# EAGLE design midi_block_R2_2 (EAGLE 6.6.0)
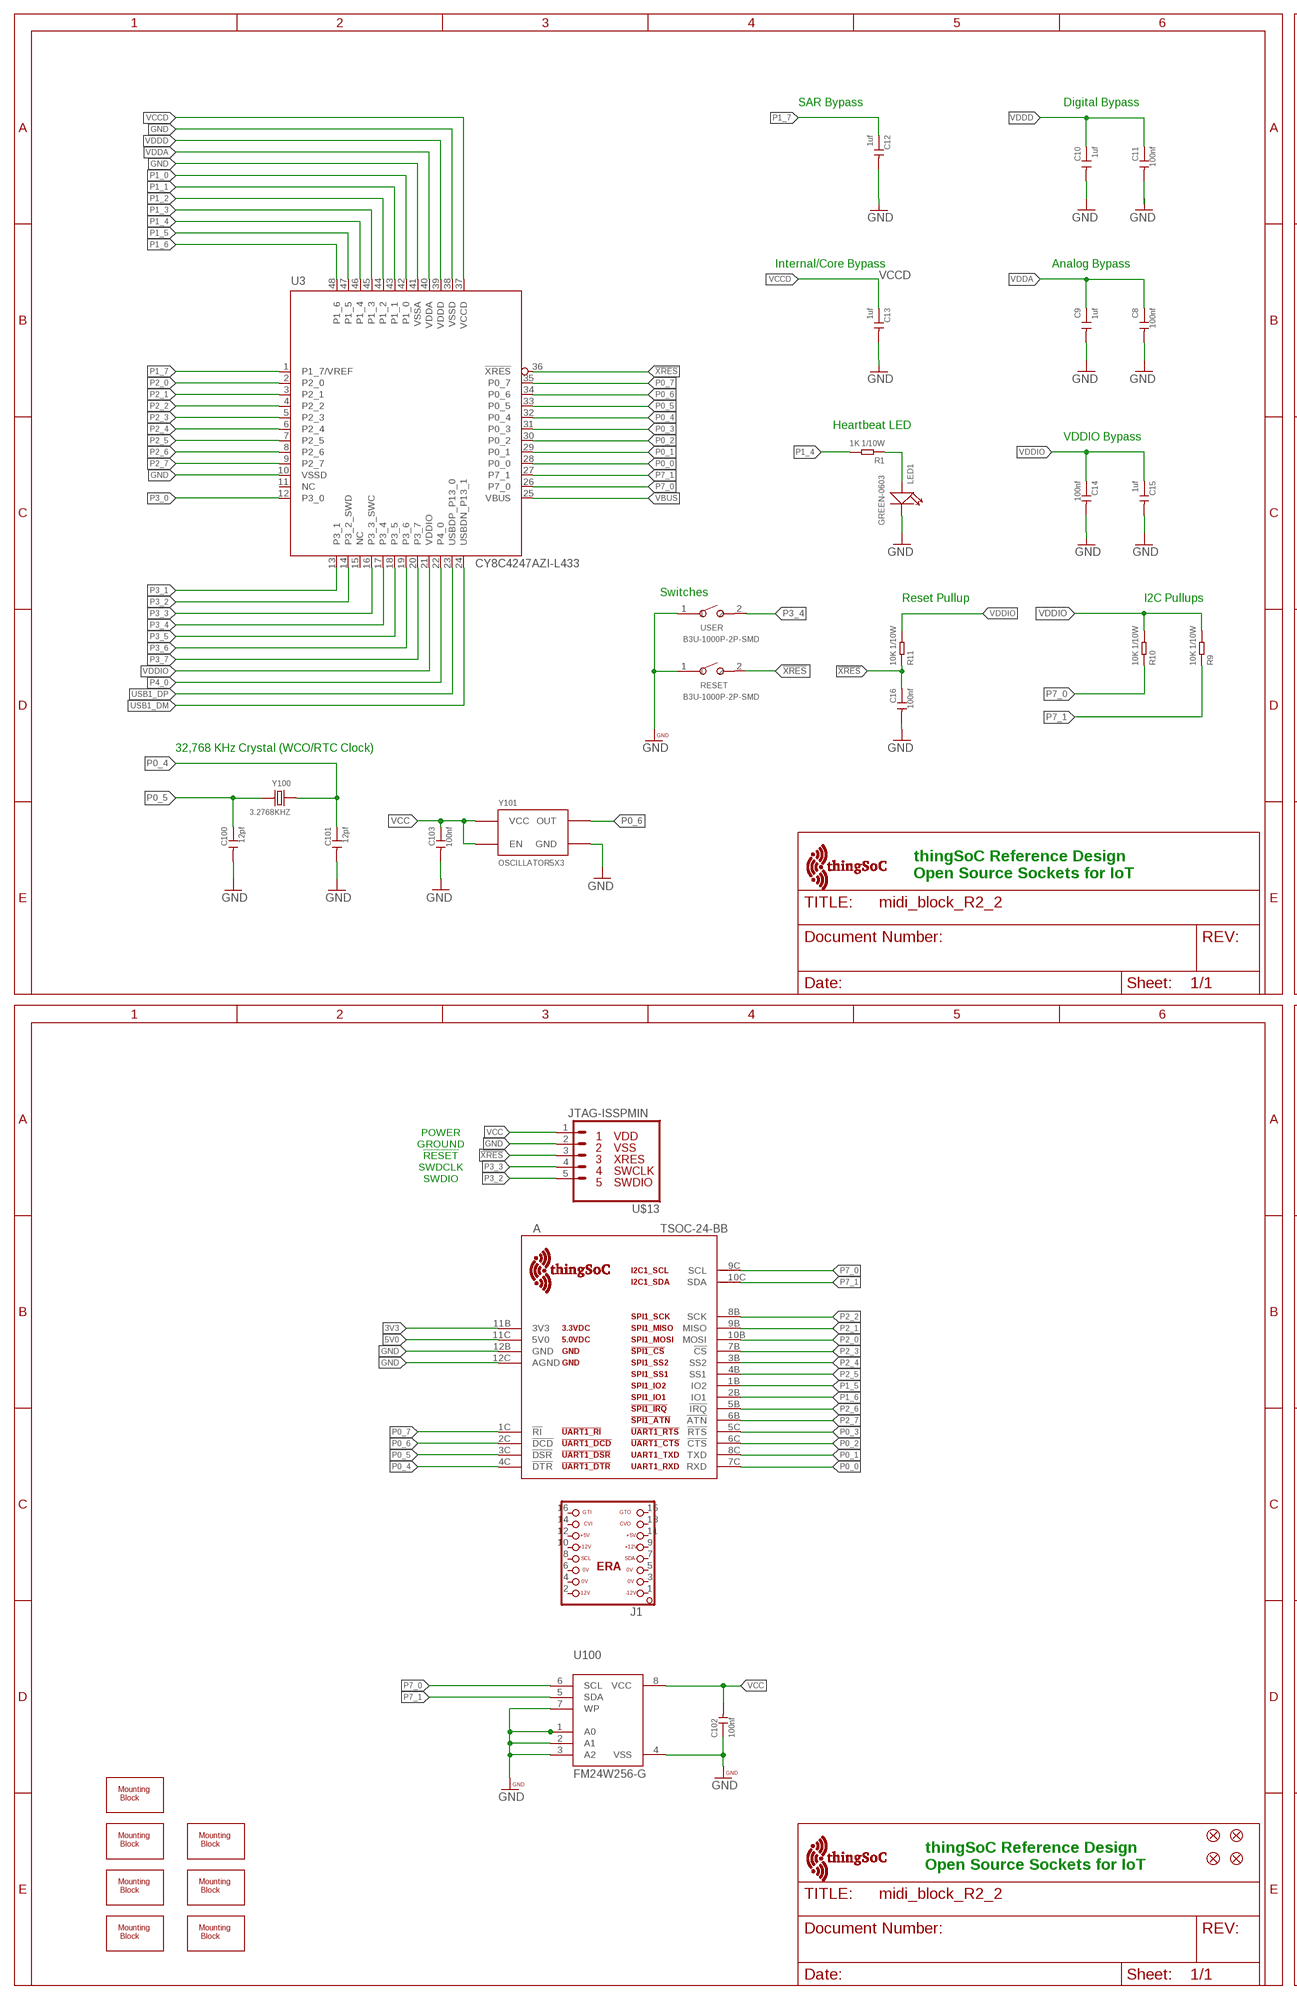
[diagram p0: schematic, sheet 1, part 1 of 2]
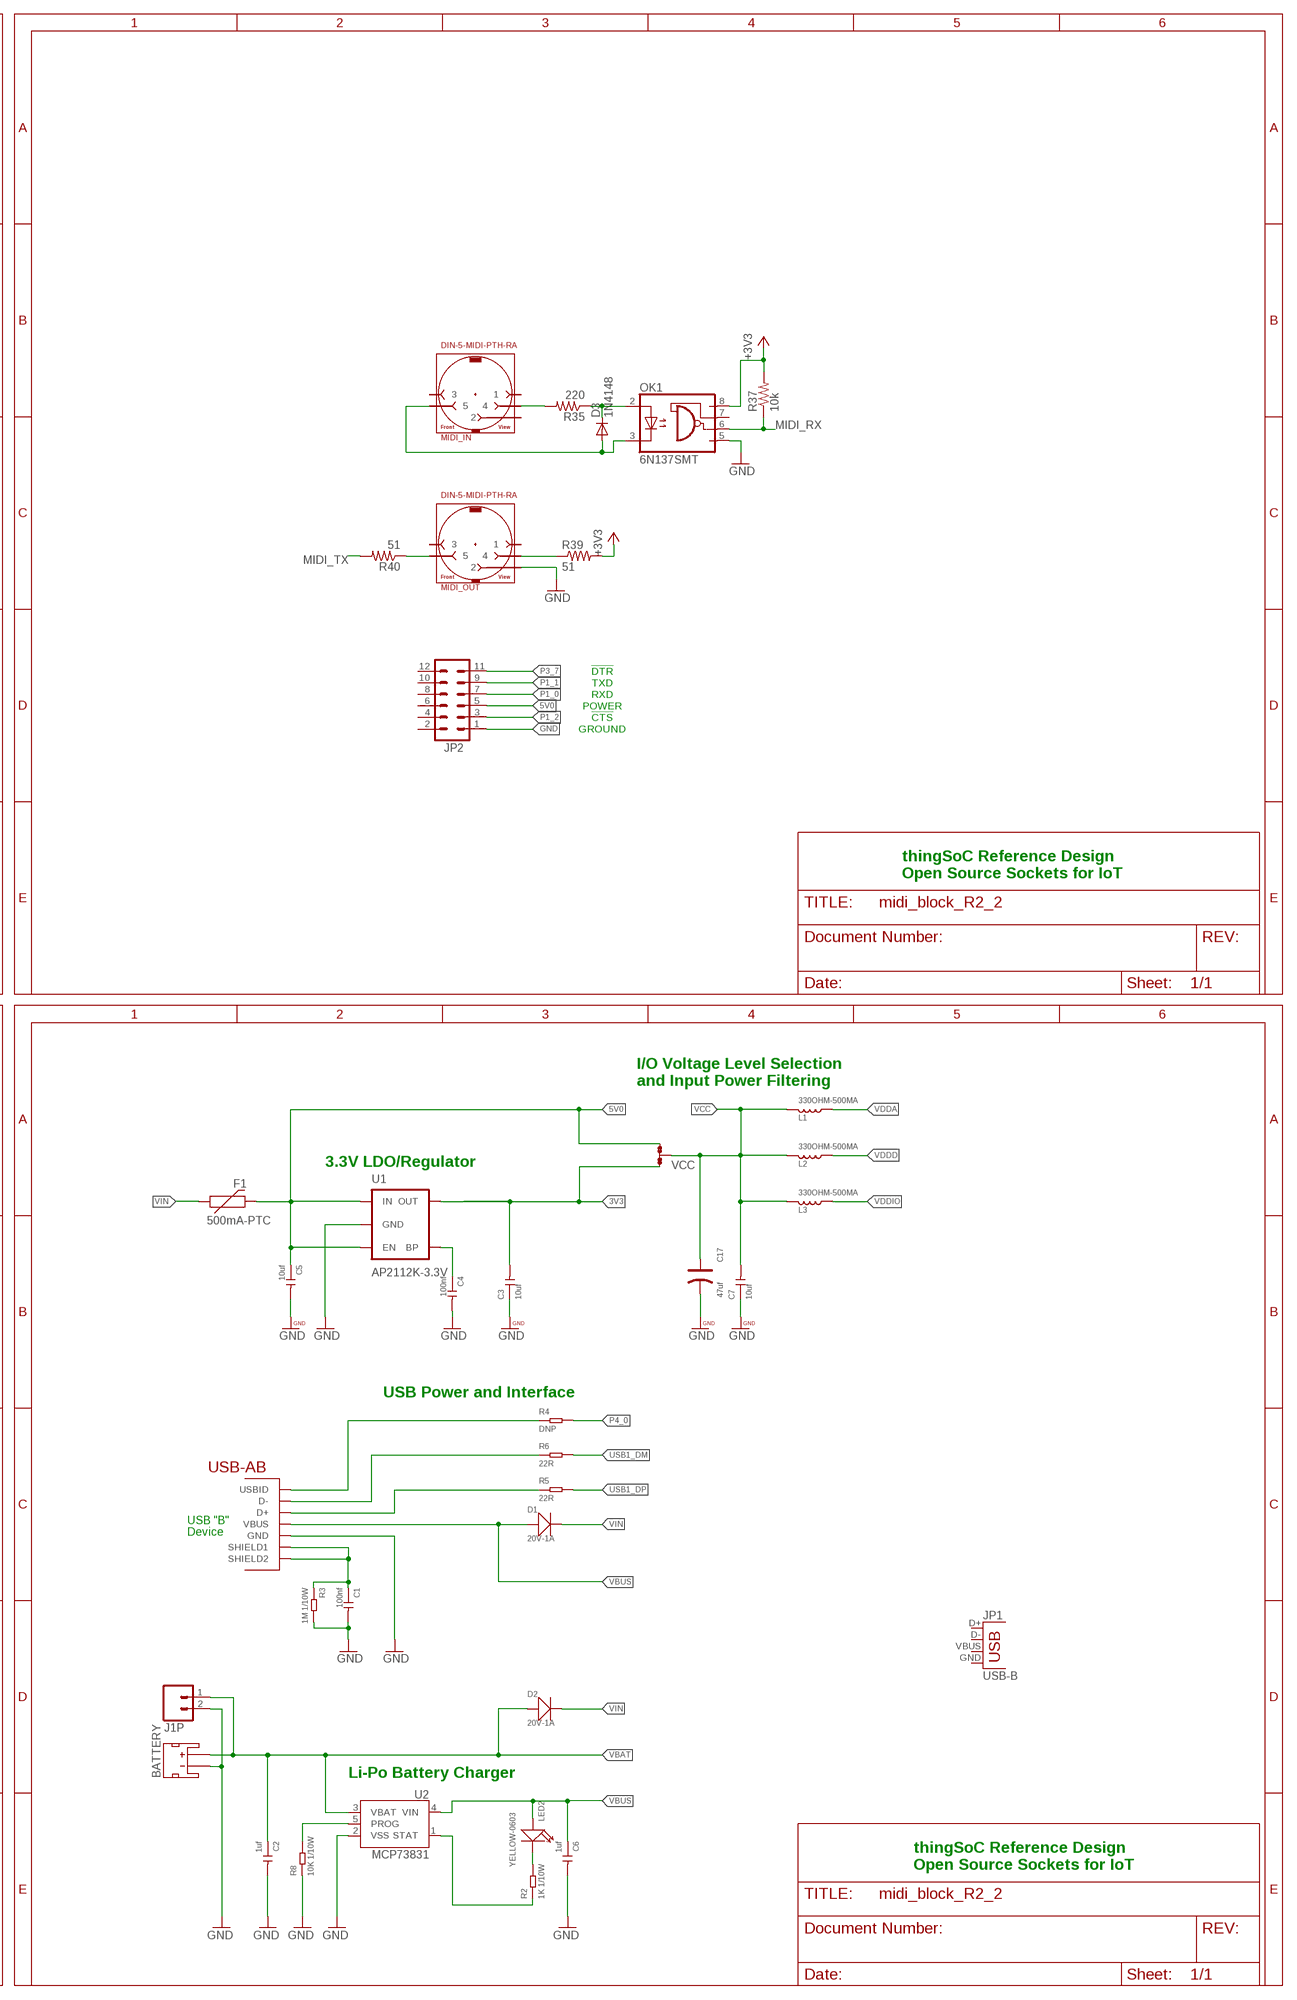
[diagram p1: schematic, sheet 1, part 2 of 2]

## Parts
A  TSOC-24-BB  [TSOC-BB-S24]
BATTERY  JST_2MM_MALE  [JST-2-SMD]
C1  100nf  CERAMIC-100NF-50V-10%-X7R(0603)  [C0603]
C2  1uf  CERAMIC-1UF-25V-10%-X7R(0603)  [C0603]
C3  10uf  CERAMIC-10UF-10V-10%-X5R(0603)  [C0603]
C4  100nf  CERAMIC-100NF-50V-10%-X7R(0603)  [C0603]
C5  10uf  CERAMIC-10UF-10V-10%-X5R(0603)  [C0603]
C6  1uf  CERAMIC-1UF-25V-10%-X7R(0603)  [C0603]
C7  10uf  CERAMIC-10UF-10V-10%-X5R(0603)  [C0603]
C8  100nf  CERAMIC-100NF-50V-10%-X7R(0603)  [C0603]
C9  1uf  CERAMIC-1UF-25V-10%-X7R(0603)  [C0603]
C10  1uf  CERAMIC-1UF-25V-10%-X7R(0603)  [C0603]
C11  100nf  CERAMIC-100NF-50V-10%-X7R(0603)  [C0603]
C12  1uf  CERAMIC-1UF-25V-10%-X7R(0603)  [C0603]
C13  1uf  CERAMIC-1UF-25V-10%-X7R(0603)  [C0603]
C14  100nf  CERAMIC-100NF-50V-10%-X7R(0603)  [C0603]
C15  1uf  CERAMIC-1UF-25V-10%-X7R(0603)  [C0603]
C16  100nf  CERAMIC-100NF-50V-10%-X7R(0603)  [C0603]
C17  47uf  TANTALUM-SMD-47UF-6.3V(AVX-A)  [AVX-A]
C100  12pf  CERAMIC-12PF-50V-5%-NPO(0603)  [C0603]
C101  12pf  CERAMIC-12PF-50V-5%-NPO(0603)  [C0603]
C102  100nf  CERAMIC-100NF-50V-10%-X7R(0603)  [C0603]
C103  100nf  CERAMIC-100NF-50V-10%-X7R(0603)  [C0603]
D1  20V-1A  SMD-DIODE-SCHOTTKY-20V-1A(SOD-123)  [SOD-123]
D2  20V-1A  SMD-DIODE-SCHOTTKY-20V-1A(SOD-123)  [SOD-123]
D3  1N4148  DIODE-SOD323-W  [SOD323-W]
F1  500mA-PTC  PTCSMD  [PTC-1206]
FID1  FIDUCIALUFIDUCIAL  [MICRO-FIDUCIAL]
FID2  FIDUCIALUFIDUCIAL  [MICRO-FIDUCIAL]
FID3  FIDUCIALUFIDUCIAL  [MICRO-FIDUCIAL]
FID4  FIDUCIALUFIDUCIAL  [MICRO-FIDUCIAL]
J1  ERA-SHROUD  [ERA]
J1P  M02-JST-2-PTH-NO_SILK  [JST-2-PTH-NS]
JP1  USB-B  USBPTH  [USB-B-PTH]
JP2  M06X2FEMALE-SMT  [2X6_SMD]
L1  330OHM-500MA  SMD-FERRITE-CHIP-120-OHM-500MA(0603)  [L0603]
L2  330OHM-500MA  SMD-FERRITE-CHIP-120-OHM-500MA(0603)  [L0603]
L3  330OHM-500MA  SMD-FERRITE-CHIP-120-OHM-500MA(0603)  [L0603]
LED1  GREEN-0603  SMD-LED-CLEAR-GREEN(0603)  [LED-0603]
LED2  YELLOW-0603  SMD-LED-CLEAR-YELLOW(0603)  [LED-0603]
MIDI_IN  DIN-5-MIDI-PTH-RA  [DIN-5-PTH-RA-SUPPORT]
MIDI_OUT  DIN-5-MIDI-PTH-RA  [DIN-5-PTH-RA-SUPPORT]
OK1  6N137SMT  [DIL8-SMD]
R1  1K 1/10W  SMD-RES-1K-5%-1/10W(0603)  [R0603]
R2  1K 1/10W  SMD-RES-1K-5%-1/10W(0603)  [R0603]
R3  1M 1/10W  SMD-RES-1M-5%-1/10W(0603)  [R0603]
R4  DNP  SMD-RES-22R-5%-1/10W(0603)  [R0603]
R5  22R  SMD-RES-22R-5%-1/10W(0603)  [R0603]
R6  22R  SMD-RES-22R-5%-1/10W(0603)  [R0603]
R8  10K 1/10W  SMD-RES-10K-5%-1/10W(0603)  [R0603]
R9  10K 1/10W  SMD-RES-10K-5%-1/10W(0603)  [R0603]
R10  10K 1/10W  SMD-RES-10K-5%-1/10W(0603)  [R0603]
R11  10K 1/10W  SMD-RES-10K-5%-1/10W(0603)  [R0603]
R35  220  R-US_R0603  [R0603]
R37  10k  R-US_R0603  [R0603]
R39  51  R-US_R0603  [R0603]
R40  51  R-US_R0603  [R0603]
RESET  B3U-1000P-2P-SMD  SMD-BUTTON(2P-3.0X2.5X1.2+0.4MM)-B3U-1000P-2P-SMD  [SW2-2.6-3.0X2.5X1.2+0.4MM]
U1  AP2112K-3.3V  V_REG_LDOSMD  [SOT23-5]
U2  MCP73831  [SOT23-5]
U3  CY8C4247AZI-L433  [TQFP-7X7-48]
U100  FM24W256-G  [SO08]
U$1  PCB-MB-SIDE  [PCB-MB-01-SIDE]
U$7  PCB-MB-SIDE  [PCB-MB-01-SIDE]
U$8  PCB-MB-SIDE  [PCB-MB-01-SIDE]
U$9  PCB-MB-SIDE  [PCB-MB-01-SIDE]
U$10  PCB-MB-SIDE  [PCB-MB-01-SIDE]
U$11  PCB-MB-SIDE  [PCB-MB-01-SIDE]
U$12  PCB-MB-SIDE  [PCB-MB-01-SIDE]
U$13  JTAG-ISSPMIN  [PSOC_JTAG_MINSILK]
U$100  TSOC-LOGO-LRG  [TSOC-LOGO-LRG]
U$101  TSOC-LOGO-SMALL  [TSOC-LOGO-SML]
USB  USB_AB  [USB-AB-MICRO-SMD]
USER  B3U-1000P-2P-SMD  SMD-BUTTON(2P-3.0X2.5X1.2+0.4MM)-B3U-1000P-2P-SMD  [SW2-2.6-3.0X2.5X1.2+0.4MM]
VCC  JMP-3-1_2  [JMP-3-1_2]
Y100  3.2768KHZ  SMD-CRYSTAL-32.768KHZ-12.5PF-20PPM-90K(2P-L2.0X1.2MM)  [X2-SMD-L2.0X1.2X0.55MM]
Y101  OSCILLATOR5X3  [CRYSTAL-SMD-5X3]

## Nets
3V3: A.11B(3V3) C3.2 U1.5(OUT) VCC.1
5V0: A.11C(5V0) C5.1 F1.2 JP2.5 U1.1(IN) U1.3(EN) VCC.3
!XRES: C16.1 R11.1 RESET.2 U3.36(!XRES) U$13.3
+3V3: OK1.8(VCC) R37.2 R39.2
BYPASS1: C4.1 U1.4(BP)
CLED: LED2.- R2.2
CSTAT: R2.1 U2.1(STAT)
GND: A.12B(GND) A.12C(AGND) BATTERY.1(-) C1.2 C2.2 C3.1 C4.2 C5.2 C6.2 C7.1 C8.2 C9.2 C10.2 C11.2 C12.2 C13.2 C14.2 C15.2 C16.2 C17.- C100.2 C101.2 C102.1 C103.2 J1P.2 JP2.1 LED1.- MIDI_OUT.2 OK1.5(GND) R3.2 R8.1 RESET.1 U1.2(GND) U2.2(VSS) U3.10(VSSD) U3.38(VSSD) U3.41(VSSA) U100.1(A0) U100.2(A1) U100.3(A2) U100.4(VSS) U100.7(WP) U$13.2 USB.GND USER.1 Y101.2(GND)
MIDI_RX: OK1.6(VO) R37.1
MIDI_TX: R40.2
N$1: R8.2 U2.5(PROG)
N$8: D3.C OK1.2(A) R35.1
N$9: MIDI_IN.4 R35.2
N$10: MIDI_OUT.5 R40.1
N$12: D3.A MIDI_IN.5 OK1.3(C)
N$13: MIDI_OUT.4 R39.1
N$17: LED1.+ R1.1
P0_0: A.7C(RXD) U3.28(P0_0)
P0_1: A.8C(TXD) U3.29(P0_1)
P0_2: A.6C(!CTS) U3.30(P0_2)
P0_3: A.5C(!RTS) U3.31(P0_3)
P0_4: A.4C(!DTR) C101.1 U3.32(P0_4) Y100.1
P0_5: A.3C(!DSR) C100.1 U3.33(P0_5) Y100.2
P0_6: A.2C(!DCD) U3.34(P0_6) Y101.3(OUT)
P0_7: A.1C(!RI) U3.35(P0_7)
P1_0: JP2.7 U3.42(P1_0)
P1_1: JP2.9 U3.43(P1_1)
P1_2: JP2.3 U3.44(P1_2)
P1_3: U3.45(P1_3)
P1_4: R1.2 U3.46(P1_4)
P1_5: A.1B(IO2) U3.47(P1_5)
P1_6: A.2B(IO1) U3.48(P1_6)
P1_7: C12.1 U3.1(P1_7/VREF)
P2_0: A.10B(MOSI) U3.2(P2_0)
P2_1: A.9B(MISO) U3.3(P2_1)
P2_2: A.8B(SCK) U3.4(P2_2)
P2_3: A.7B(!CS) U3.5(P2_3)
P2_4: A.3B(SS2) U3.6(P2_4)
P2_5: A.4B(SS1) U3.7(P2_5)
P2_6: A.5B(!IRQ) U3.8(P2_6)
P2_7: A.6B(!ATN) U3.9(P2_7)
P3_0: U3.12(P3_0)
P3_1: U3.13(P3_1)
P3_2: U3.14(P3_2_SWD) U$13.5
P3_3: U3.16(P3_3_SWC) U$13.4
P3_4: U3.17(P3_4) USER.2
P3_5: U3.18(P3_5)
P3_6: U3.19(P3_6)
P3_7: JP2.11 U3.20(P3_7)
P4_0: R4.2 U3.22(P4_0)
P7_0: A.9C(SCL) R10.1 U3.26(P7_0) U100.6(SCL)
P7_1: A.10C(SDA) R9.1 U3.27(P7_1) U100.5(SDA)
USB1_DM: R6.2 U3.24(USBDN_P13_1)
USB1_DP: R5.2 U3.23(USBDP_P13_0)
USB1_I: R4.1 USB.ID(USBID)
USB1_M: R6.1 USB.D-
USB1_P: R5.1 USB.D+
USB1_SHIELD: C1.1 R3.1 USB.SHIELD1 USB.SHIELD2
VBAT: BATTERY.2(+) C2.1 D2.+ J1P.1 U2.3(VBAT)
VBUS: C6.1 D1.+ LED2.+ U2.4(VIN) U3.25(VBUS) USB.VBUS
VCC: C7.2 C17.+ C102.2 C103.1 L1.1 L2.1 L3.1 U100.8(VCC) U$13.1 VCC.2 Y101.1(EN) Y101.4(VCC)
VCCD: C13.1 U3.37(VCCD)
VDDA: C8.1 C9.1 L1.2 U3.40(VDDA)
VDDD: C10.1 C11.1 L2.2 U3.39(VDDD)
VDDIO: C14.1 C15.1 L3.2 R9.2 R10.2 R11.2 U3.21(VDDIO)
VIN: D1.- D2.- F1.1
Unconnected: BATTERY.NC1(PAD1) BATTERY.NC2(PAD2) J1.1 J1.2 J1.3 J1.4 J1.5 J1.6 J1.7 J1.8 J1.9 J1.10 J1.11 J1.12 J1.13 J1.14 J1.15 J1.16 JP1.D+ JP1.D- JP1.GND JP1.VBUS JP2.2 JP2.4 JP2.6 JP2.8 JP2.10 JP2.12 MIDI_IN.1 MIDI_IN.2 MIDI_IN.3 MIDI_OUT.1 MIDI_OUT.3 OK1.7(VE) U3.11(NC) U3.15(NC)

## Notes on the sheet
- SAR Bypass | Digital Bypass
- Internal/Core Bypass | Analog Bypass
- Heartbeat LED
- VDDIO Bypass
- Switches
- Reset Pullup | I2C Pullups
- !DTR
- TXD
- RXD
- POWER
- !CTS
- GROUND
- 32,768 KHz Crystal (WCO/RTC Clock)
- thingSoC Reference Design
  Open Source Sockets for IoT
- thingSoC Reference Design
  Open Source Sockets for IoT
- I/O Voltage Level Selection
  and Input Power Filtering
- POWER
- GROUND
- !RESET
- SWDCLK | 3.3V LDO/Regulator
- SWDIO
- USB Power and Interface
- USB "B"
- Device
- Li-Po Battery Charger
- thingSoC Reference Design
  Open Source Sockets for IoT
- thingSoC Reference Design
  Open Source Sockets for IoT

## Library data of the parts
A = thingSoC:TSOC-24: thingSoC Twenty-Four(24) Pin Socket Source LBR : http://www.thingsoc.com Github : https://github.com/thingsoc License : http://creativecommons.org/licenses/by-sa/4.0/ (Creative Commons 4.0) THIS SOFTWARE IS PROVIDED BY THE CONTRIBUTORS "AS IS" AND WITHOUT ANY EXPRESS OR IMPLIED WARRANTIES, INCLUDING, BUT NOT LIMITED TO, THE IMPLIED WARRANTIES OF MERCHANTABILITY AND FITNESS FOR A PARTICULAR PURPOSE ARE DISCLAIMED. IN NO EVENT SHALL THE COPYRIGHT OWNER OR CONTRIBUTORS BE LIABLE FOR ANY DIRECT, INDIRECT, INCIDENTAL, SPECIAL, EXEMPLARY, OR CONSEQUENTIAL DAMAGES (INCLUDING, BUT NOT LIMITED TO, PROCUREMENT OF SUBSTITUTE GOODS OR SERVICES; LOSS OF USE, DATA, OR PROFITS; OR BUSINESS INTERRUPTION) HOWEVER CAUSED AND ON ANY THEORY OF LIABILITY, WHETHER IN CONTRACT, STRICT LIABILITY, OR TORT (INCLUDING NEGLIGENCE OR OTHERWISE) ARISING IN ANY WAY OUT OF THE USE OF THIS SOFTWARE, EVEN IF ADVISED OF THE POSSIBILITY OF SUCH DAMAGE.
BATTERY = TSOC-ESP8266-BASE:JST_2MM_MALE: Mates to single-cell LiPo batteries. CONN-11443 Now with smashable polarity marks!; BTM_NEG: -; BTM_POS: +; PROD_ID: CONN-11443; TOP_NEG: -; TOP_POS: +
C1 C4 C8 C11 C14 C16 C102 C103 = Seeed-Capacitor-2016:CERAMIC-100NF-50V-10%-X7R(0603): 302010138; MPN: CC0603KRX7R9BB104
C2 C6 C9 C10 C12 C13 C15 = Seeed-Capacitor-2016:CERAMIC-1UF-25V-10%-X7R(0603): 302010139; MPN: CC0603KRX7R8BB105
C3 C5 C7 = Seeed-Capacitor-2016:CERAMIC-10UF-10V-10%-X5R(0603): 302010103; MPN: CC0603KRX5R6BB106
C17 = Seeed-Capacitor-2016:TANTALUM-SMD-47UF-6.3V(AVX-A): 302020005; MPN: TAJA476*006#NJ
C100 C101 = Seeed-Capacitor-2016:CERAMIC-12PF-50V-5%-NPO(0603): 302010067; MPN: CC0603JRNPO9BN120
D1 D2 = Seeed-Diode-2016:SMD-DIODE-SCHOTTKY-20V-1A(SOD-123): 304020034; MPN: B5819W
D3 = diode:DIODE-: DIODE
F1 = SparkFun:PTC: Resettable Fuse PTC Resettable Fuse. Spark Fun Electronics SKU : COM-08357
FID1-FID4 = TSOC-ESP8266-BASE:FIDUCIAL: Fiducial Alignment Points Various fiducial points for machine vision alignment.
J1 = ERA:ERA: EuroRack2 - Backplane Connector
J1P = TSOC-ESP8266-BASE:M02: Standard 2-pin 0.1" header. Use with - straight break away headers ( PRT-00116) - right angle break away headers (PRT-00553) - swiss pins (PRT-00743) - machine pins (PRT-00117) - female headers (PRT-00115) Molex polarized connector foot print use with: PRT-08233 with associated crimp pins and housings. 2.54_SCREWTERM for use with PRT-10571. 3.5mm Screw Terminal footprints for PRT-08084 5mm Screw Terminal footprints for use with PRT-08432
JP1 = SparkFun-Connectors:USB: USB Connectors USB-B-PTH is fully proven SKU : PRT-00139/CONN-08278 USB-miniB is fully proven SKU : PRT-00587 USB-A-PCB is untested. USB-A-H is throughly reviewed, but untested. Spark Fun Electronics SKU : PRT-00437 USB-B-SMT is throughly reviewed, but untested. Needs silkscreen touching up. USB-A-S has not been used/tested USB-MB-H has not been used/tested USB-MICROB has been used. CONN-09505; PROD_ID: CONN-08278
JP2 = halcyonmod_Connectors:M06X2
L1-L3 = Seeed-Inductor-2016:SMD-FERRITE-CHIP-120-OHM-500MA(0603): 303030001; MPN: BLM18AG121SN1D; VALUE: 120OHM-500MA
LED1 = Seeed-LED-2016:SMD-LED-CLEAR-GREEN(0603): 304090043; MPN: 19-217-G7C-AN1P2-3T
LED2 = Seeed-LED-2016:SMD-LED-CLEAR-YELLOW(0603): 304090044; MPN: 19-217-Y5C-AM1N1VY-3T
MIDI_IN MIDI_OUT = oXo_connectors:DIN-5-MIDI: DIN-5 (MIDI) connector
OK1 = og-optocouplers:6N137: MOTOROLA OPTO COUPLER
R1 R2 = Seeed-Resistor-2016:SMD-RES-1K-5%-1/10W(0603): 301010291; MPN: RC0603JR-071KL
R3 = Seeed-Resistor-2016:SMD-RES-1M-5%-1/10W(0603): 301010100; MPN: RC0603JR-071ML
R4 = Seeed-Resistor-2016:SMD-RES-22R-5%-1/10W(0603): 301010289; MPN: RC0603JR-0722RL; VALUE: 22R
R5 R6 = Seeed-Resistor-2016:SMD-RES-22R-5%-1/10W(0603): 301010289; MPN: RC0603JR-0722RL
R8-R11 = Seeed-Resistor-2016:SMD-RES-10K-5%-1/10W(0603): 301010293; MPN: RC0603JR-0710KL
R35 R37 R39 R40 = rcl:R-US_: RESISTOR, American symbol
RESET USER = Seeed-Switch-2016:SMD-BUTTON(2P-3.0X2.5X1.2+0.4MM): 311020047; MPN: B3U-1000P-2P-SMD
U1 = SparkFun-PowerIC:V_REG_LDO: Voltage Regulator LDO Standard 150mA LDO voltage regulator in SOT-23 layout. Micrel part MIC5205. BP (by-pass) pin is used to lower output noise with 470pF cap.; PROD_ID: VREG-12457
U2 = TSOC-ESP8266-BASE:MCP73831: Miniature single cell, fully integrated Li-Ion, Li-polymer charge management controller http://ww1.microchip.com/downloads/en/DeviceDoc/20001984g.pdf IC-09995; PROD_ID: IC-09995
U3 = PatternAgents-Cypress:CY8C4247AZI-L433: Cypress PSoC® 4 - Programmable System on Chip, Cortex-M0 Based : USB Version! http://www.cypress.com/?mpn=CY8C4247AZI-L433 LBR Source: http://www.patternagents.com THIS SOFTWARE IS PROVIDED BY THE CONTRIBUTORS "AS IS" AND WITHOUT ANY EXPRESS OR IMPLIED WARRANTIES, INCLUDING, BUT NOT LIMITED TO, THE IMPLIED WARRANTIES OF MERCHANTABILITY AND FITNESS FOR A PARTICULAR PURPOSE ARE DISCLAIMED. IN NO EVENT SHALL THE COPYRIGHT OWNER OR CONTRIBUTORS BE LIABLE FOR ANY DIRECT, INDIRECT, INCIDENTAL, SPECIAL, EXEMPLARY, OR CONSEQUENTIAL DAMAGES (INCLUDING, BUT NOT LIMITED TO, PROCUREMENT OF SUBSTITUTE GOODS OR SERVICES; LOSS OF USE, DATA, OR PROFITS; OR BUSINESS INTERRUPTION) HOWEVER CAUSED AND ON ANY THEORY OF LIABILITY, WHETHER IN CONTRACT, STRICT LIABILITY, OR TORT (INCLUDING NEGLIGENCE OR OTHERWISE) ARISING IN ANY WAY OUT OF THE USE OF THIS SOFTWARE, EVEN IF ADVISED OF THE POSSIBILITY OF SUCH DAMAGE.
U100 = PatternAgents-Cypress:FM24W256: I2C FRAM FM24W256
U$1 U$7-U$12 = halcyonmod_Hardware:PCB-MB: Mounting Block Hardware Attaches two PCB's at a Right Angle using #4 Self-Threading Screws Source: http://www.essentracomponents.com.sg/images-line/pdfs/PCB-MB.pdf
U$13 = PatternAgents-Cypress:JTAG-ISSP: JTAG-ISSP Programming Connector (5 Pin ISSP JTAG Connector) LBR Source: http://www.patternagents.com THIS SOFTWARE IS PROVIDED BY THE CONTRIBUTORS "AS IS" AND WITHOUT ANY EXPRESS OR IMPLIED WARRANTIES, INCLUDING, BUT NOT LIMITED TO, THE IMPLIED WARRANTIES OF MERCHANTABILITY AND FITNESS FOR A PARTICULAR PURPOSE ARE DISCLAIMED. IN NO EVENT SHALL THE COPYRIGHT OWNER OR CONTRIBUTORS BE LIABLE FOR ANY DIRECT, INDIRECT, INCIDENTAL, SPECIAL, EXEMPLARY, OR CONSEQUENTIAL DAMAGES (INCLUDING, BUT NOT LIMITED TO, PROCUREMENT OF SUBSTITUTE GOODS OR SERVICES; LOSS OF USE, DATA, OR PROFITS; OR BUSINESS INTERRUPTION) HOWEVER CAUSED AND ON ANY THEORY OF LIABILITY, WHETHER IN CONTRACT, STRICT LIABILITY, OR TORT (INCLUDING NEGLIGENCE OR OTHERWISE) ARISING IN ANY WAY OUT OF THE USE OF THIS SOFTWARE, EVEN IF ADVISED OF THE POSSIBILITY OF SUCH DAMAGE.
U$100 U$101 = thingSoC:TSOC-LOGO: thingSoC Logo Source LBR : http://www.thingsoc.com Github : https://github.com/thingsoc License : http://creativecommons.org/licenses/by-sa/4.0/ (Creative Commons 4.0) THIS SOFTWARE IS PROVIDED BY THE CONTRIBUTORS "AS IS" AND WITHOUT ANY EXPRESS OR IMPLIED WARRANTIES, INCLUDING, BUT NOT LIMITED TO, THE IMPLIED WARRANTIES OF MERCHANTABILITY AND FITNESS FOR A PARTICULAR PURPOSE ARE DISCLAIMED. IN NO EVENT SHALL THE COPYRIGHT OWNER OR CONTRIBUTORS BE LIABLE FOR ANY DIRECT, INDIRECT, INCIDENTAL, SPECIAL, EXEMPLARY, OR CONSEQUENTIAL DAMAGES (INCLUDING, BUT NOT LIMITED TO, PROCUREMENT OF SUBSTITUTE GOODS OR SERVICES; LOSS OF USE, DATA, OR PROFITS; OR BUSINESS INTERRUPTION) HOWEVER CAUSED AND ON ANY THEORY OF LIABILITY, WHETHER IN CONTRACT, STRICT LIABILITY, OR TORT (INCLUDING NEGLIGENCE OR OTHERWISE) ARISING IN ANY WAY OUT OF THE USE OF THIS SOFTWARE, EVEN IF ADVISED OF THE POSSIBILITY OF SUCH DAMAGE.
USB = BeeSafe:USB_AB: This is a USB AB connector that is compatible with USB OTG. i.e. this connector can serve as a host or device
VCC = PatternAgents-ProtoPads:JMP-3-1_2: Three Terminal Jumper - 1 & 2 Connected Positions 1and 2 are normally connected. PatternAgents ProtoPads Library Schematic and PCB layout libraries for design patterns by PatternAgents. For the CADSoft Eagle CAD program : http://www.cadsoftusa.com/download-eagle/ Source LBR : http://www.patternagents.com Github : https://github.com/PatternAgents License : http://creativecommons.org/licenses/by-sa/4.0/ (Creative Commons 4.0) THIS SOFTWARE IS PROVIDED BY THE CONTRIBUTORS "AS IS" AND WITHOUT ANY EXPRESS OR IMPLIED WARRANTIES, INCLUDING, BUT NOT LIMITED TO, THE IMPLIED WARRANTIES OF MERCHANTABILITY AND FITNESS FOR A PARTICULAR PURPOSE ARE DISCLAIMED. IN NO EVENT SHALL THE COPYRIGHT OWNER OR CONTRIBUTORS BE LIABLE FOR ANY DIRECT, INDIRECT, INCIDENTAL, SPECIAL, EXEMPLARY, OR CONSEQUENTIAL DAMAGES (INCLUDING, BUT NOT LIMITED TO, PROCUREMENT OF SUBSTITUTE GOODS OR SERVICES; LOSS OF USE, DATA, OR PROFITS; OR BUSINESS INTERRUPTION) HOWEVER CAUSED AND ON ANY THEORY OF LIABILITY, WHETHER IN CONTRACT, STRICT LIABILITY, OR TORT (INCLUDING NEGLIGENCE OR OTHERWISE) ARISING IN ANY WAY OUT OF THE USE OF THIS SOFTWARE, EVEN IF ADVISED OF THE POSSIBILITY OF SUCH DAMAGE.; BOM: EXCLUDE
Y100 = Seeed-Crystal Oscillator-2016:SMD-CRYSTAL-32.768KHZ-12.5PF-20PPM-90K(2P-L2.0X1.2MM): 306010020; MPN: FC-12M
Y101 = SparkFun-FreqCtrl:OSCILLATOR: Generic 5x3 and 7x5 oscillators

## Net classes
1 vcc: width 0.254 mm

## Board
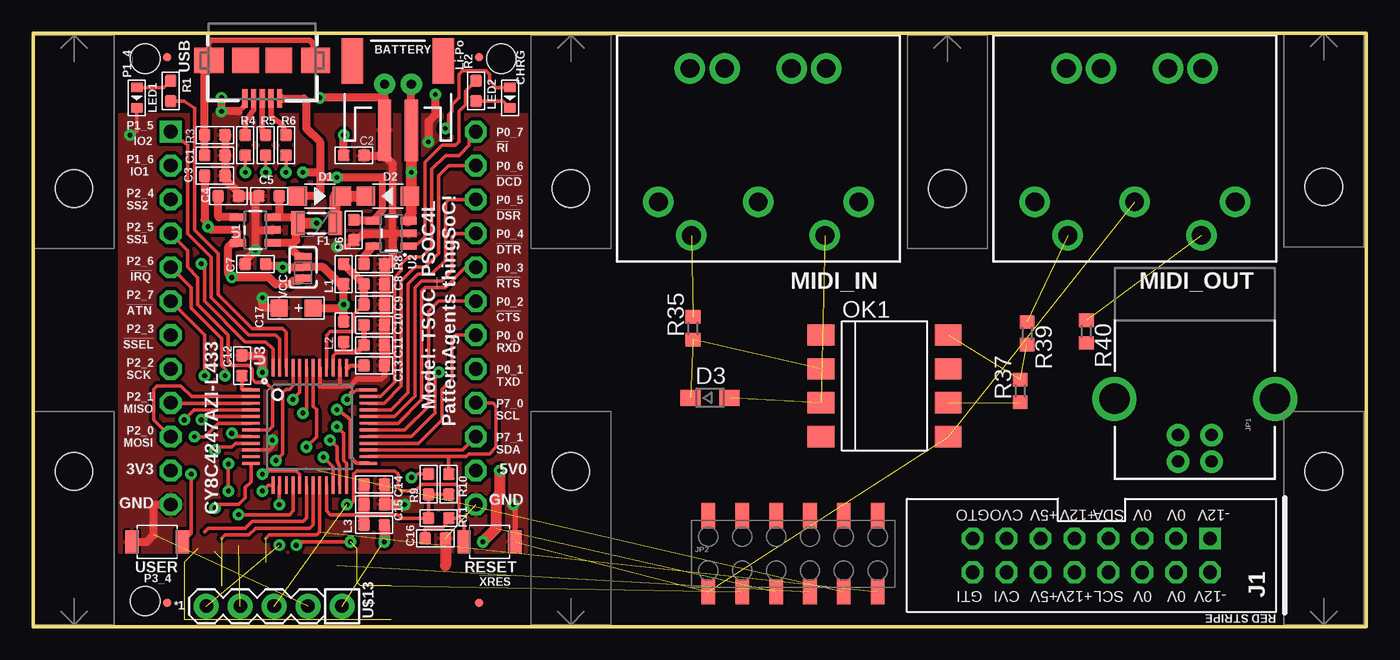
[diagram p2: board, top side]
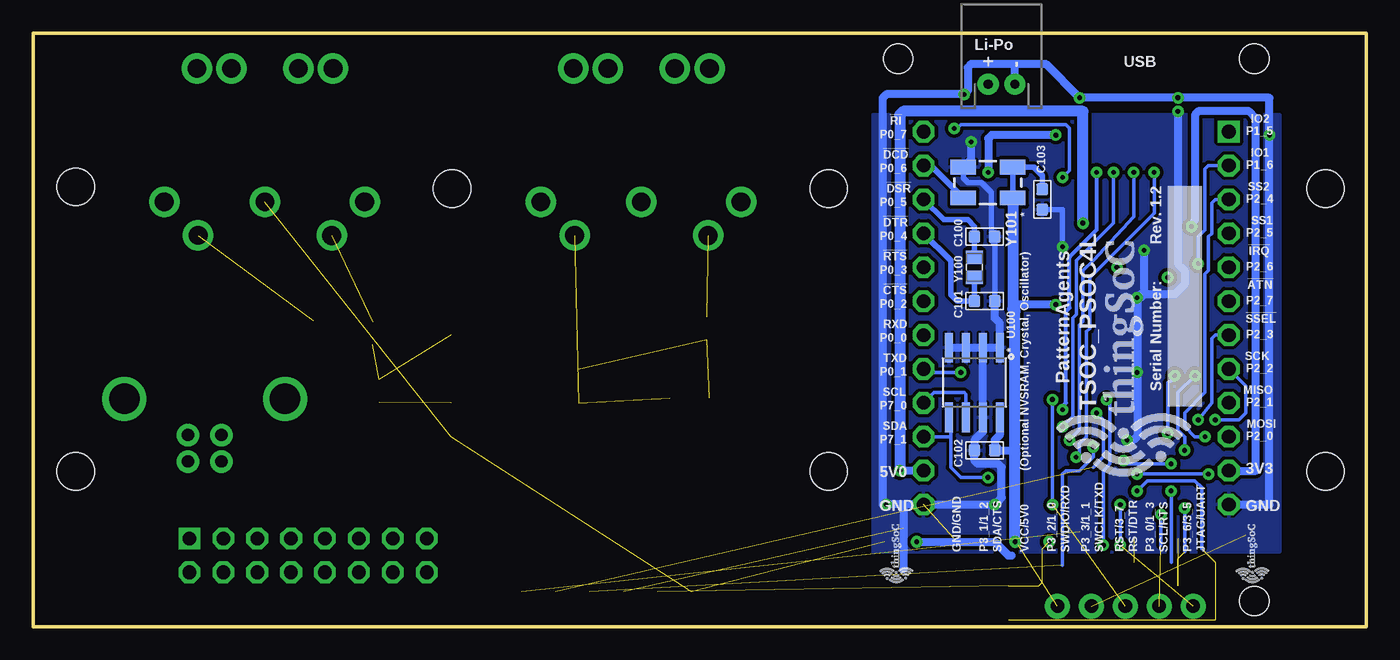
[diagram p3: board, bottom side, seen from below]

Size 99.82 x 44.45 mm. Coordinates in mm from the lower left corner, seen from the top.
Outline: 0,0 0,44.45 99.82,44.45 99.82,0 0,0
Copper layers (1*16): Top 0.035mm / dielectric 1.5mm / Bottom 0.035mm
Design rules "PatternAgents_7mil": minimum track width 7mil, minimum drill 14mil, track to track 7mil, track to pad 7mil, pad to pad 7mil, via to via 7mil, smd to smd 7mil, copper to edge 7mil, drill to drill 7mil, minimum pad ring 12mil, minimum via ring 10mil, stop-mask expansion 4mil, vias tented up to drill 25mil, thermal gap 7mil
Holes 2.2 mm at 8.38,1.91 35.05,42.55 8.38,42.55

### Footprints (pad centres in the part's own frame; a part is rotated, then mirrored left to right if it is on the bottom)
TSOC-BB-S24 = drill 1.016 square: 1B -11.43,11.43 | drill 1.016 octagon: 1C 11.43,11.43; 2B -11.43,8.89; 2C 11.43,8.89; 3B -11.43,6.35; 3C 11.43,6.35; 4B -11.43,3.81; 4C 11.43,3.81; 5B -11.43,1.27; 5C 11.43,1.27; 6B -11.43,-1.27; 6C 11.43,-1.27; 7B -11.43,-3.81; 7C 11.43,-3.81; 8B -11.43,-6.35; 8C 11.43,-6.35; 9B -11.43,-8.89; 9C 11.43,-8.89; 10B -11.43,-11.43; 10C 11.43,-11.43; 11B -11.43,-13.97; 11C 11.43,-13.97; 12B -11.43,-16.51; 12C 11.43,-16.51
JST-2-SMD = smd 1 x 4.6: 1 -1,-3.7; 2 1,-3.7 | smd 1.6 x 3.4: NC1 -3.4,1.5; NC2 3.4,1.5
C0603 = smd 0.889 x 0.889: 1 0,0.762; 2 0,-0.762
AVX-A = smd 1.27 x 1.27: + -1.27,0; - 1.27,0
SOD-123 = smd 1.397 x 1.397: + -1.651,0; - 1.651,0
SOD323-W = smd 1.5 x 1.2: A 1.45,0; C -1.45,0
PTC-1206 = smd 1 x 1.8: 1 -1.4,0; 2 1.4,0
MICRO-FIDUCIAL = smd 0.635 x 0.635: 1 0,0
ERA = drill 1.016 square: 1 -8.89,-1.27 | drill 1.016 octagon: 2 -8.89,1.27; 3 -6.35,-1.27; 4 -6.35,1.27; 5 -3.81,-1.27; 6 -3.81,1.27; 7 -1.27,-1.27; 8 -1.27,1.27; 9 1.27,-1.27; 10 1.27,1.27; 11 3.81,-1.27; 12 3.81,1.27; 13 6.35,-1.27; 14 6.35,1.27; 15 8.89,-1.27; 16 8.89,1.27
JST-2-PTH-NS = drill 0.7 pad 1.6: 1 -1,0; 2 1,0
USB-B-PTH = drill 0.914 pad 1.676: D+ 0,1.25; D- 1.981,1.25; GND 0,-1.25; VBUS 1.981,-1.25 | drill 2.286: S1 -2.718,-6.02; S2 -2.718,6.02
2X6_SMD = smd 1.02 x 1.9: 1 -5.08,-2.85; 2 -5.08,2.85; 3 -2.54,-2.85; 4 -2.54,2.85; 5 0,-2.85; 6 0,2.85; 7 2.54,-2.85; 8 2.54,2.85; 9 5.08,-2.85; 10 5.08,2.85; 11 7.62,-2.85; 12 7.62,2.85
L0603 = smd 0.889 x 0.889: 1 -0.762,0; 2 0.762,0
LED-0603 = smd 0.762 x 0.889: + -0.762,0; - 0.762,0
DIN-5-PTH-RA-SUPPORT = drill 1.4 pad 2.286: 1 7.54,3.6; 2 0.06,3.61; 3 -7.47,3.6; 4 5.07,6.13; 5 -4.93,6.12; SR1 -5.03,-6.382; SR2 -2.43,-6.382; SR3 2.57,-6.382; SR4 5.178,-6.382
DIL8-SMD = smd 1.6 x 2: 1 -3.81,-4.77; 2 -1.27,-4.77; 3 1.27,-4.77; 4 3.81,-4.77; 5 3.81,4.77; 6 1.27,4.77; 7 -1.27,4.77; 8 -3.81,4.77
R0603 = smd 0.889 x 0.889: 1 0,0.762; 2 0,-0.762
R0603' = smd 1 x 1.1: 1 -0.85,0; 2 0.85,0
SW2-2.6-3.0X2.5X1.2+0.4MM = smd 1 x 1.7: 1 -1.9,0; 2 1.9,0
SOT23-5 = smd 0.55 x 1.2: 1 -0.95,-1.3; 2 0,-1.3; 3 0.95,-1.3; 4 0.95,1.3; 5 -0.95,1.3
TQFP-7X7-48 = smd 1.3 x 0.21: 1 -4.4,2.75; 2 -4.4,2.25; 3 -4.4,1.75; 4 -4.4,1.25; 5 -4.4,0.75; 6 -4.4,0.25; 7 -4.4,-0.25; 8 -4.4,-0.75; 9 -4.4,-1.25; 10 -4.4,-1.75; 11 -4.4,-2.25; 12 -4.4,-2.75; 25 4.4,-2.75; 26 4.4,-2.25; 27 4.4,-1.75; 28 4.4,-1.25; 29 4.4,-0.75; 30 4.4,-0.25; 31 4.4,0.25; 32 4.4,0.75; 33 4.4,1.25; 34 4.4,1.75; 35 4.4,2.25; 36 4.4,2.75 | smd 0.21 x 1.3: 13 -2.75,-4.4; 14 -2.25,-4.4; 15 -1.75,-4.4; 16 -1.25,-4.4; 17 -0.75,-4.4; 18 -0.25,-4.4; 19 0.25,-4.4; 20 0.75,-4.4; 21 1.25,-4.4; 22 1.75,-4.4; 23 2.25,-4.4; 24 2.75,-4.4; 37 2.75,4.4; 38 2.25,4.4; 39 1.75,4.4; 40 1.25,4.4; 41 0.75,4.4; 42 0.25,4.4; 43 -0.25,4.4; 44 -0.75,4.4; 45 -1.25,4.4; 46 -1.75,4.4; 47 -2.25,4.4; 48 -2.75,4.4
SO08 = smd 0.61 x 2.21: 1 -1.905,-2.616; 2 -0.635,-2.616; 3 0.635,-2.616; 4 1.905,-2.616; 5 1.905,2.616; 6 0.635,2.616; 7 -0.635,2.616; 8 -1.905,2.616
PCB-MB-01-SIDE = hole 2.8: 3.5,0
PSOC_JTAG_MINSILK = drill 1.016 pad 1.88: 1 -5.08,0; 2 -2.54,0; 3 0,0; 4 2.54,0; 5 5.08,0
USB-AB-MICRO-SMD = smd 1.4 x 0.4: D+ 2.85,0; D- 2.85,0.65; GND 2.85,-1.3; ID 2.85,-0.65; VBUS 2.85,1.3 | smd 1.9 x 2: P$6 0,1.25; P$7 0,-1.25 | smd 1.9 x 2.2: SHIELD1 0,4; SHIELD2 0,-4
JMP-3-1_2 = smd 0.508 x 1.27: 1 -0.813,0; 2 0,0; 3 0.813,0
X2-SMD-L2.0X1.2X0.55MM = smd 1 x 1.25: 1 -0.75,0; 2 0.75,0
CRYSTAL-SMD-5X3 = smd 1.9 x 1.1: 1 -1.85,-1.15; 2 1.85,-1.15; 3 1.85,1.15; 4 -1.85,1.15

### Placement (x,y rotation side)
A  21.72,25.65 0 top
BATTERY  27.3,40.89 0 top
C1  13.59,35.31 90 top
C2  24,35.31 90 top
C3  13.59,33.78 270 top
C4  14.61,32.26 90 top
C5  17.65,32.26 270 top
C6  24,29.72 0 top
C7  16.64,27.18 90 top
C8  25.53,25.65 90 top
C9  25.53,24.13 90 top
C10  25.53,22.61 90 top
C11  25.53,21.08 90 top
C12  15.62,19.56 180 top
C13  25.53,19.56 90 top
C14  25.53,10.67 90 top
C15  25.53,9.14 90 top
C16  30.1,6.6 90 top
C17  19.68,23.88 180 top
C100  28.57,29.21 90 bottom
C101  28.57,24.38 90 bottom
C102  28.57,13.21 90 bottom
C103  24.26,32 0 bottom
D1  21.46,32.26 0 top
D2  26.54,32.26 180 top
D3  50.67,17.14 0 top
F1  21.21,30.23 180 top
FID1  10.03,42.67 90 top
FID2  33.4,42.67 90 top
FID3  10.03,1.78 90 top
FID4  33.4,1.78 90 top
J1  79.25,5.33 180 top
J1P  27.3,40.64 0 bottom
JP1  87,14.35 270 top
JP2  55.63,5.46 0 top
L1  23.24,26.42 90 top
L2  23.24,22.1 270 top
L3  25.53,7.62 180 top
LED1  7.75,39.62 270 top
LED2  35.69,39.62 270 top
MIDI_IN  54.36,35.43 180 top
MIDI_OUT  82.55,35.43 180 top
OK1  63.75,18.03 270 top
R1  10.29,40.13 0 top
R2  33.15,40.13 0 top
R3  13.59,36.83 90 top
R4  15.88,36.07 0 top
R5  17.4,36.07 0 top
R6  18.92,36.07 0 top
R8  25.53,27.18 270 top
R9  29.59,10.67 0 top
R10  31.11,10.67 0 top
R11  30.35,8.13 270 top
R35  220  [R0603']  49.4,22.35 90 top
R37  10k  [R0603']  73.91,17.65 90 top
R39  51  [R0603']  74.42,21.97 270 top
R40  51  [R0603']  78.87,22.1 270 top
RESET  34.16,6.35 180 top
U1  16.64,29.72 90 top
U2  26.8,29.46 90 top
U3  20.7,14.99 0 top
U100  29.34,18.29 180 bottom
U$1  96.65,36.45 270 top
U$7  3.05,36.32 270 top
U$8  40.26,36.32 270 top
U$9  68.45,36.32 270 top
U$10  3.05,8.13 90 top
U$11  96.65,8.13 90 top
U$12  40.26,8.13 90 top
U$13  18.03,1.52 180 top
U$100  18.16,14.48 90 bottom
U$101  8.51,4.06 90 bottom
U$102  TSOC-LOGO-SMALL  [TSOC-LOGO-SML]  35.18,4.06 90 bottom
USB  17.14,42.42 270 top
USER  9.27,6.35 0 top
VCC  20.19,26.92 90 top
Y100  29.34,26.92 90 bottom
Y101  28.32,33.27 180 bottom

### Tracks (layer width: path | path; a pad name or v marks a point on that pad's centre or on a via)
3V3  (via drill 0.36)
  Top 0.61: 15.27,28.7 15.27,29.56 15.11,29.72 13.34,29.72 v13.08,29.97 12.83,30.48 C3.2 | 15.27,28.7 14.86,28.7 14.61,28.45 14.61,26.42 v14.86,26.16 17.65,26.16 18.16,25.65 19.18,25.65 19.43,25.91 19.94,25.91 20.14,26.11 VCC.1 | 15.27,28.7 U1.5
  Bottom 0.61: A.11B 8.26,11.68 8.26,38.1 8.76,38.61 12.57,38.61 12.83,38.35 12.83,30.48 v13.08,29.97
5V0  (via drill 0.36)  (1 unrouted)
  Top 0.61: C5.1 18.41,30.7 U1.3 19.62,30.67 F1.2 19.68,30.61 19.68,28.96 19.5,28.77 | U1.1 19.5,28.77 | VCC.3 19.89,27.74 19.43,28.19 19.43,28.7 19.5,28.77
  Top 0.813: F1.2 v21.21,30.23 | v34.92,11.68 34.92,9.91 34.67,9.65 34.67,7.37 v33.66,6.35
  Bottom 0.61: A.11C v34.92,11.68 | v33.66,6.35 27.81,6.35 26.8,5.33 26.54,5.33
  Bottom 0.813: v21.21,30.23 21.21,38.61 34.67,38.61 34.92,38.35 v34.92,11.68
!XRES  (via drill 0.36)  (1 unrouted)
  Top 0.254: U3.36 24.21,17.74 24,17.53 23.75,17.53 v23.5,17.02 | C16.1 29.34,7.37 30.61,7.37 30.86,7.62 R11.1 31.88,8.13 | RESET.2 32.26,7.74 31.88,8.13 | v23.5,9.14 23.75,9.14 24,9.4 24,11.43 24.26,11.68 27.05,11.68 27.3,11.43 27.3,10.41 27.56,10.16 28.57,10.16 29.08,10.67 31.62,10.67 31.88,10.41 31.88,8.13
  Bottom 0.254: v23.5,17.02 v23.5,9.14
+3V3  (2 unrouted)
BYPASS1
  Top 0.61: U1.4 13.91,30.67 13.84,30.73 C4.1
CLED
  Top 0.254: R2.2 35.18,39.37 LED2.-
CSTAT
  Top 0.254: U2.1 28.16,28.45 28.83,28.7 29.34,29.21 29.34,34.8 30.61,36.07 31.62,36.07 31.88,36.32 31.88,38.61 32.38,39.12 32.38,40.13 R2.1
GND  (via drill 0.36)  (5 unrouted)
  Top 0.254: LED1.- 7.75,37.08 v7.24,36.83 | U3.10 17.68,13.24 17.91,13.46 v17.91,13.97
  Top 0.305: U3.38 22.95,18.07 22.99,18.03 | U3.41 21.45,18.05 21.46,18.03
  Top 0.406: USB.GND 15.85,39.09 15.37,38.61 | C13.2 26.29,18.8 26.04,18.54 24.26,18.54 23.75,18.03 22.99,18.03 21.46,18.03 | RESET.1 36.06,9.02 v35.94,9.14 | v22.73,28.45 23.5,28.45 C6.2
  Top 0.508: U2.2 26.92,29.46 26.92,34.29
  Top 0.61: 15.37,38.61 v14.1,38.61 v14.1,39.62 | R3.2 C1.2 C3.1 14.35,33.53 15.11,32.77 C4.2 C5.2 16.64,32 16.64,29.72 | 26.29,35.31 26.29,37.18 BATTERY.1 26.29,37.21 26.29,39.62 | C2.2 26.29,35.31 | R8.1 26.8,27.18 26.92,27.56 26.92,29.46 24.77,29.46 C6.2 | 26.29,39.62 v21.46,39.62 | 26.29,39.62 26.29,40.62 J1P.2 | 16.64,29.72 U1.2 | USER.1 8.51,6.35 9.02,6.86 9.02,8.89 9.27,9.14 A.12B | 26.92,34.29 26.92,34.67 26.29,35.31 | 16.64,29.72 v16.64,28.19 15.88,27.43 C7.1 | C12.2 16.89,20.32 17.14,20.07 v17.14,19.05 | v30.1,39.88 30.1,38.35 29.59,37.85 v29.59,36.32 | C17.- 17.4,23.88 17.14,24.13 v17.14,24.64
  Top 0.813: R8.1 C8.2 C9.2 C10.2 C11.2 C13.2 | C14.2 C15.2 v27.81,9.14 | C16.2 30.86,4.57
  Bottom 0.406: C101.2 27.81,28.7 | 27.81,28.7 C100.2 | Y101.2 30.17,33.6 29.84,33.27 28.83,33.27 28.07,32.51 28.07,28.96 27.81,28.7 | C103.2 22.73,31.24 v22.73,28.45
  Bottom 0.61: 34.67,9.14 v35.94,9.14 36.2,9.14 36.2,39.62 35.94,39.88 v30.1,39.88 29.84,40.13 29.84,41.91 29.59,42.16 26.29,42.16 | 26.29,42.16 24,42.16 v21.46,39.62 v14.1,39.62 7.24,39.62 v7.24,36.83 7.24,9.14 A.12B | v14.1,38.61 14.1,27.18 13.59,26.67 13.59,25.65 14.35,24.89 16.38,24.89 | 16.38,24.89 16.64,24.89 | 16.64,24.89 16.89,24.89 v17.14,24.64 | v17.14,24.64 v17.14,19.05 17.14,14.25 17.4,14 17.88,14 v17.91,13.97 | v29.59,36.32 29.59,35 Y101.2 | U100.4 U100.3 U100.2 | U100.2 U100.7 28.7,14.61 29.34,13.97 C102.1 29.34,12.45 29.08,12.19 27.56,12.19 27.3,11.94 27.3,9.65 v27.81,9.14 A.12C 34.67,9.14 | U100.2 U100.1 27.43,22.73 27.81,23.11 C101.2 | v16.64,28.19 16.64,25.15 16.38,24.89 | J1P.2 26.3,42.15 26.29,42.16 | v17.14,24.64 16.89,24.64 16.64,24.89 | 34.67,9.14 34.67,4.32
  pour Top (isolate 0.254, hatched): 36.96,5.59 6.48,5.59 6.48,38.35 36.96,38.35
  pour Bottom (isolate 0.254, hatched): 36.96,5.59 6.48,5.59 6.48,38.35 36.96,38.35
MIDI_RX  (1 unrouted)
N$1
  Top 0.61: R8.2 24.77,27.72 U2.5
N$8  (2 unrouted)
N$9  (1 unrouted)
N$10  (1 unrouted)
N$12  (2 unrouted)
N$13  (1 unrouted)
N$17
  Top 0.254: LED1.+ 9.78,40.39 R1.1
P0_0
  Top 0.254: U3.28 28.85,13.74 30.61,15.49 30.61,17.78 31.37,18.54 31.37,21.59 31.62,21.84 A.7C
P0_1  (via drill 0.36)
  Top 0.254: U3.29 28.33,14.24 30.1,16 30.1,19.05 v30.35,19.05
  Bottom 0.254: v30.35,19.05 32.89,19.05 A.8C
P0_2
  Top 0.254: U3.30 27.82,14.74 29.59,16.51 29.59,23.62 30.35,24.38 A.6C
P0_3
  Top 0.254: A.5C 32.38,26.92 30.86,25.4 29.34,25.4 29.08,25.15 29.08,17.02 27.3,15.24 U3.31
P0_4
  Top 0.254: U3.32 27.04,15.74 28.57,17.27 28.57,25.4 29.08,25.91 30.61,25.91 31.37,26.67 31.37,29.21 31.62,29.46 A.4C
  Bottom 0.406: A.4C 31.11,27.43 31.11,24.89 30.61,24.38 C101.1 Y100.1
P0_5
  Top 0.254: A.3C 31.11,32 30.86,31.75 30.86,27.43 29.84,26.42 28.83,26.42 28.07,25.65 28.07,17.53 26.78,16.24 U3.33
  Bottom 0.406: C100.1 Y100.2 29.34,29.97 29.84,30.48 31.62,30.48 A.3C
P0_6
  Top 0.254: A.2C 31.11,34.54 30.35,33.78 30.35,27.94 29.34,26.92 28.57,26.92 27.56,25.91 27.56,18.03 26.26,16.74 U3.34
  Bottom 0.406: A.2C 32.59,34.54 Y101.3
P0_7
  Top 0.254: U3.35 26,17.24 27.05,18.29 27.05,26.16 27.56,26.67 27.56,27.18 28.07,27.69 29.08,27.69 29.84,28.45 29.84,34.29 30.86,35.31 31.88,35.31 32.64,36.07 32.64,36.58 A.1C
P1_0  (via drill 0.36)  (1 unrouted)
  Top 0.254: U3.42 20.95,16.51 21.21,16.26 21.21,14.22 v20.45,13.46
  Bottom 0.254: v20.45,13.46 20.45,12.7 21.46,11.68 22.48,11.68 22.73,11.43 22.73,4.57
P1_1  (via drill 0.36)  (1 unrouted)
  Top 0.254: U3.43 20.45,16.26 v20.19,16
  Bottom 0.254: 20.45,11.94 19.68,12.7 19.68,15.49 v20.19,16
P1_2  (via drill 0.36)  (5 unrouted)
  Top 0.254: U3.44 19.95,17.54 v19.43,17.02 | v23.75,6.35 19.94,6.35 v19.68,6.1
  Bottom 0.254: v19.68,6.1 19.68,11.68 19.18,12.19 19.18,16.76 v19.43,17.02
P1_3  (via drill 0.36)
  Top 0.254: v14.61,10.16 v14.61,12.19 | U3.45 19.45,18.05 19.18,17.78 18.92,17.78 18.67,17.53 18.67,12.95 v18.16,12.45
  Bottom 0.254: v14.61,12.19 17.91,12.19 v18.16,12.45 | v14.61,10.16 14.61,4.83
P1_4
  Top 0.254: R1.2 11.3,39.37 12.06,38.86 12.06,29.72 13.84,27.94 13.84,24.89 16.38,22.35 18.67,22.35 18.95,22.07 U3.46
P1_5
  Top 0.254: A.1B 11.56,36.07 11.56,29.46 13.34,27.69 13.34,24.64 16.13,21.84 18.16,21.84 18.45,21.55 U3.47
P1_6  (via drill 0.36)
  Top 0.254: v12.57,27.18 12.83,27.18 12.83,24.38 15.88,21.34 17.4,21.34 17.95,20.78 U3.48
  Bottom 0.254: v12.57,27.18 12.57,29.21 12.06,29.72 12.06,34.29 11.81,34.54 A.2B
P1_7
  Top 0.305: U3.1 15.66,17.74 15.62,17.78 C12.1
P2_0
  Top 0.254: U3.2 11.85,17.24 11.05,18.03 9.27,18.03 9.02,17.78 9.02,15.49 A.10B
P2_1
  Top 0.254: U3.3 10.31,16.74 A.9B
P2_2  (via drill 0.36)
  Top 0.254: U3.4 12.04,16.24 v11.3,15.49
  Bottom 0.254: v11.3,15.49 9.53,15.49 9.02,16 9.02,18.03 A.8B
P2_3  (via drill 0.36)
  Top 0.254: U3.5 13.07,15.74 v12.57,15.49
  Bottom 0.254: v12.57,15.49 11.56,16.76 11.56,21.59 11.3,21.84 A.7B
P2_4  (via drill 0.36)
  Top 0.254: U3.6 13.84,15.24 12.83,14.22 v12.06,14.22
  Bottom 0.254: v12.06,14.22 12.83,14.22 13.59,14.99 13.59,16 12.06,17.53 12.06,26.42 11.81,26.67 11.81,29.21 11.56,29.46 11.56,31.75 11.3,32 A.3B
P2_5
  Top 0.254: A.4B 11.56,28.19 11.56,26.92 12.32,26.16 12.32,24.13 14.61,21.84 14.61,19.81 14.86,19.56 16.13,19.56 16.38,19.3 16.38,18.54 16.64,18.29 17.4,18.29 17.91,17.78 17.91,14.99 17.65,14.73 U3.7
P2_6  (via drill 0.36)
  Top 0.254: U3.8 15.1,14.24 v14.86,14.48 | v14.35,18.8 14.35,19.3 14.1,19.56 14.1,21.59 11.81,23.88 11.81,25.4 A.5B
  Bottom 0.254: v14.35,18.8 14.35,18.54 14.86,18.29 v14.86,14.48
P2_7  (via drill 0.36)
  Top 0.254: U3.9 15.13,13.74 14.86,13.46 13.84,13.46 v13.59,13.21 | v12.83,18.8 12.83,21.84 A.6B
  Bottom 0.254: v13.59,13.21 13.59,14.22 14.1,14.73 14.1,17.53 v12.83,18.8
P3_0  (via drill 0.36)  (2 unrouted)
  Top 0.254: U3.12 16.3,10.84 15.88,10.41 15.88,9.65 15.37,9.14 13.84,9.14 v13.59,8.89
  Bottom 0.254: 13.59,5.59 v13.59,8.89
P3_1  (via drill 0.36)  (3 unrouted)
  Top 0.254: U3.13 17.57,10.59 v17.14,10.16
  Bottom 0.254: v17.14,10.16 16.38,10.92 12.83,10.92 12.32,10.41 12.32,5.84
P3_2  (via drill 0.36)  (1 unrouted)
  Top 0.254: v18.41,9.14 18.41,10.55 U3.14
  Bottom 0.254: v18.41,6.1 v18.41,9.14
P3_3  (via drill 0.36)  (1 unrouted)
  Top 0.254: U3.16 19.45,8.66 19.18,8.38 v15.37,8.38
  Bottom 0.254: v15.37,8.38 15.37,6.1
P3_4  (via drill 0.36)
  Top 0.254: U3.17 19.95,11.42 19.68,11.68 17.4,11.68 v17.14,11.43 | v11.81,11.43 11.81,6.99 USER.2
  Bottom 0.254: v17.14,11.43 v11.81,11.43
P3_5
  Top 0.254: U3.18 20.45,8.13 20.19,7.87 16.38,7.87 15.88,7.37 13.08,7.37 12.83,7.11
P3_6  (1 unrouted)
  Top 0.254: U3.19 20.95,7.62 20.7,7.37 16.64,7.37 16.13,6.86 14.35,6.86 14.1,6.6
P3_7  (2 unrouted)
  Top 0.254: U3.20 21.45,7.1 21.21,6.86 17.65,6.86 17.4,6.6
P4_0  (via drill 0.36)
  Top 0.254: R4.2 v15.88,34.04 | U3.22 22.45,11.97 v21.72,12.7
  Bottom 0.254: v15.88,34.04 15.88,30.99 20.7,26.16 20.7,22.35 20.95,22.1 20.95,14.22 21.46,13.72 21.46,12.95 v21.72,12.7
P7_0
  Top 0.254: U3.26 31.11,12.74 | 31.11,12.74 32.42,12.74 32.64,12.95 34.16,12.95 34.67,13.46 34.67,16.51 34.42,16.76 A.9C | R10.1 31.11,12.74
  Bottom 0.254: U100.6 29.97,17.4 30.1,17.53 32.38,17.53 A.9C
P7_1  (via drill 0.36)
  Top 0.254: U3.27 32.16,13.24 A.10C | R9.1 28.83,11.43 v28.32,11.18
  Bottom 0.254: A.10C 31.11,14.22 | 31.11,14.22 31.11,11.94 30.35,11.18 v28.32,11.18 | 31.11,14.22 31.11,15.54 U100.5
USB1_DM  (via drill 0.36)
  Top 0.254: R6.2 v18.92,34.04 | U3.24 23.45,12.24 23.24,12.45 23.24,14.48 v22.73,14.99
  Bottom 0.254: v18.92,34.04 18.92,30.23 21.72,27.43 21.72,23.37 21.97,23.11 21.97,15.75 v22.73,14.99
USB1_DP  (via drill 0.36)
  Top 0.254: R5.2 v17.4,34.04 | v22.23,13.97 22.73,13.46 22.73,12.45 22.95,11.97 U3.23
  Bottom 0.254: v17.4,34.04 17.4,30.73 20.45,27.43 21.21,26.67 21.21,22.86 21.46,22.61 21.46,14.73 v22.23,13.97
USB1_I
  Top 0.406: USB.ID 16.5,38.72 15.88,37.85 R4.1
USB1_M
  Top 0.406: USB.D- 17.8,38.21 18.67,37.59 R6.1
USB1_P
  Top 0.406: USB.D+ 17.14,37.08 R5.1
USB1_SHIELD
  Top 0.406: USB.SHIELD2 13.14,43.75 13.34,43.94 20.7,43.94 20.95,43.69 20.95,42.61
  Top 0.61: C1.1 R3.1 12.83,42.1 USB.SHIELD2 12.57,41.85 | 20.95,42.61 USB.SHIELD1
VBAT  (via drill 0.36)
  Top 0.61: C2.1 v23.24,36.83 | BATTERY.2 J1P.1
  Top 0.813: BATTERY.2 v28.3,34.04 28.3,32.88 D2.+ 28.32,32.13 28.32,30.99 28,30.41 U2.3
  Bottom 0.61: v23.24,36.83 28.05,36.83 28.3,36.58 v28.3,34.04
VBUS  (via drill 0.36)
  Top 0.178: USB.VBUS 18.39,39.47 18.67,39.57
  Top 0.254: LED2.+ 34.67,40.39 34.16,40.89 34.16,41.4 33.91,41.66 32.13,41.66 31.88,41.4 31.88,39.62 31.37,39.12 31.37,38.61 31.11,38.35 31.11,37.59 v30.86,37.34
  Top 0.305: U3.25 24.21,12.24 23.75,12.7 23.75,15.49 v22.73,16.26
  Top 0.508: U2.4 25.5,30.45 26.16,31.24 26.16,33.66
  Top 0.61: 18.67,39.57 20.25,39.57 20.45,39.37 20.45,37.34 21.46,36.32 21.46,34.04 | D1.+ 21.21,32.26 21.46,32.51 21.46,33.78 | 21.46,34.04 21.46,33.78 | 26.16,33.66 v22.73,33.66 21.59,33.66 21.46,33.78 | U2.4 24.19,30.41 C6.1 | v20.19,34.04 21.46,34.04
  Bottom 0.254: v30.86,37.34 30.61,37.34 30.35,37.59 22.48,37.59 22.23,37.34 22.23,34.16 v22.73,33.66
  Bottom 0.305: v20.19,34.04 20.19,29.72 22.23,27.69 22.23,23.88 22.48,23.62 22.48,16.76 22.73,16.51 v22.73,16.26
VCC  (via drill 0.36)  (1 unrouted)
  Top 0.178: 17.5,27.03 C7.2 | 18.39,27.03 v18.67,26.92
  Top 0.305: 26.04,6.1 v26.29,6.35
  Top 0.61: v18.67,26.92 VCC.2 21.72,26.92 22.99,25.65 L1.1 v23.24,24.13 | L2.1 v23.24,24.13 | 18.39,27.03 17.5,27.03 | C17.+ 22.99,23.88 v23.24,24.13
  Top 0.813: L3.1 v26.29,6.35
  Bottom 0.406: Y101.4 Y101.1 24.9,34.42 24.26,33.78 C103.1 | 26.47,23.8 26.29,23.62
  Bottom 0.61: v23.24,24.13 26.29,24.13 | U100.8 27.43,14.35 27.81,13.97 C102.2 26.54,13.21 26.29,12.95
  Bottom 0.813: v26.29,6.35 26.29,12.95 26.29,23.62 26.29,24.13 | Y101.4 26.47,23.8
VCCD
  Top 0.305: U3.37 23.58,19.39 23.75,19.56 C13.1
VDDA
  Top 0.254: U3.40 21.95,21.82 22.23,22.1 24,22.1 24,23.37 C9.1
  Top 0.61: C9.1 C8.1 L1.2
VDDD
  Top 0.254: U3.39 22.45,20.29 22.73,20.57
  Top 0.406: C10.1 C11.1 24.26,20.57 23.24,20.57 | 22.73,20.57 23.24,20.57 | L2.2 23.24,20.57
VDDIO
  Top 0.254: R10.2 R9.2 R11.2 27.56,8.13 27.3,8.38 24.77,8.38 | U3.21 21.95,8.66 22.23,8.38 24.51,8.38 24.77,8.13
  Top 0.813: L3.2 24.77,8.13 24.77,8.38 C15.1 C14.1
VIN
  Top 0.813: F1.1 22.61,32.26 D1.- D2.-

### Text on the board
tPlace: Li-Po | P1_4 | CHRG | P1_5 | P0_7 | IO2 | !RI | P1_6 | P0_6 | IO1 | P2_4 | !DCD | P0_5 | SS2 | P2_5 | !DSR | P0_4 | SS1 | P2_6 | !DTR | P0_3 | !IRQ | P2_7 | !RTS | P0_2 | !ATN | P2_3 | !CTS | P0_0 | !SSEL | RXD | P2_2 | P0_1 | SCK | P2_1 | TXD | P7_0 | MISO | Model: TSOC_PSOC4L | P2_0 | PatternAgents thingSoC! | SCL | P7_1 | MOSI | SDA | 3V3 | 5V0 | GND | GND | CY8C4247AZI-L433 | P3_4 | !XRES | *1
bPlace: Li-Po | USB | - | + | IO2 | !RI | P1_5 | P0_7 | IO1 | !DCD | P1_6 | P0_6 | SS2 | Rev. 1.2 | !DSR | P2_4 | SS1 | * | P0_5 | !DTR | P2_5 | TSOC_PSOC4L | P0_4 | !IRQ | PatternAgents | P2_6 | !RTS | !ATN | Serial Number: | P0_3 | !CTS | P2_7 | P0_2 | !SSEL | P2_3 | RXD | SCK | * | P0_0 | TXD | P2_2 | P0_1 | MISO | P2_1 | SCL | P7_0 | MOSI | SDA | P2_0 | P7_1 | (Optional NVSRAM, Crystal, Oscillator) | 3V3 | 5V0 | GND | GND | JTAG/UART | P3_6/3_5 | SCL/RTS | P3_0/1_3 | RST/DTR | RST/3_7 | SWCLK/TXD | P3_3/1_1 | SWDIO/RXD | P3_2/1_0 | VCC/5V0 | SDA/CTS | P3_1/1_2 | GND/GND